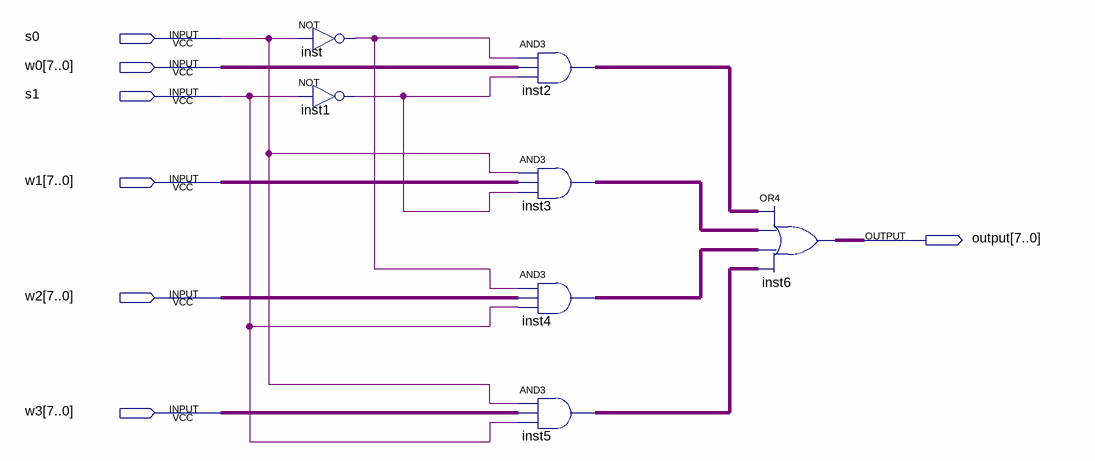
[diagram p0: schematic sheet]
// Quartus schematic busmux4-to-1.bdf as structural Verilog: 7 symbols, 7 pins
module \busmux4-to-1  (
  input  s0,
  input  [7:0] w0,
  input  s1,
  input  [7:0] w1,
  input  [7:0] w2,
  input  [7:0] w3,
  output [7:0] \output 
);

  wire inst1_out, inst_out;
  wire [7:0] inst2_out, inst3_out, inst4_out, inst5_out;

  not inst (inst_out, s0);
  not inst1 (inst1_out, s1);
  assign inst2_out = {8{inst_out}} & w0 & {8{inst1_out}};  // AND3 inst2, 8 bits wide
  assign inst3_out = {8{s0}} & w1 & {8{inst1_out}};  // AND3 inst3, 8 bits wide
  assign inst4_out = {8{inst_out}} & w2 & {8{s1}};  // AND3 inst4, 8 bits wide
  assign inst5_out = {8{s0}} & w3 & {8{s1}};  // AND3 inst5, 8 bits wide
  assign \output  = inst2_out | inst3_out | inst4_out | inst5_out;  // OR4 inst6, 8 bits wide
endmodule
